# Altium schematic sheet DCDC_Hall.SchDoc
size 420 x 297 mm; Address1: Address1; Address2: Address2; Address3: Address3; Address4: Address4; SheetNumber: 1; Scale: 1:1; Разраб.: Иванов; Обозначение документа: АБВГ.123456.001 Э3; Пров.: Петров; Утв.: Сидоров; Наименование организации: ОАО "Концерн "МПО-Гидроприбор"; Перв. применение: АБВГ.123456.000; Наименование изделия 1: Плата; Наименование изделия 2: Схема электрическая; Наименование изделия 3: принципиальная; Нач. отд.: Нач. отд.; Фамилия нач. отд.: Сидоров
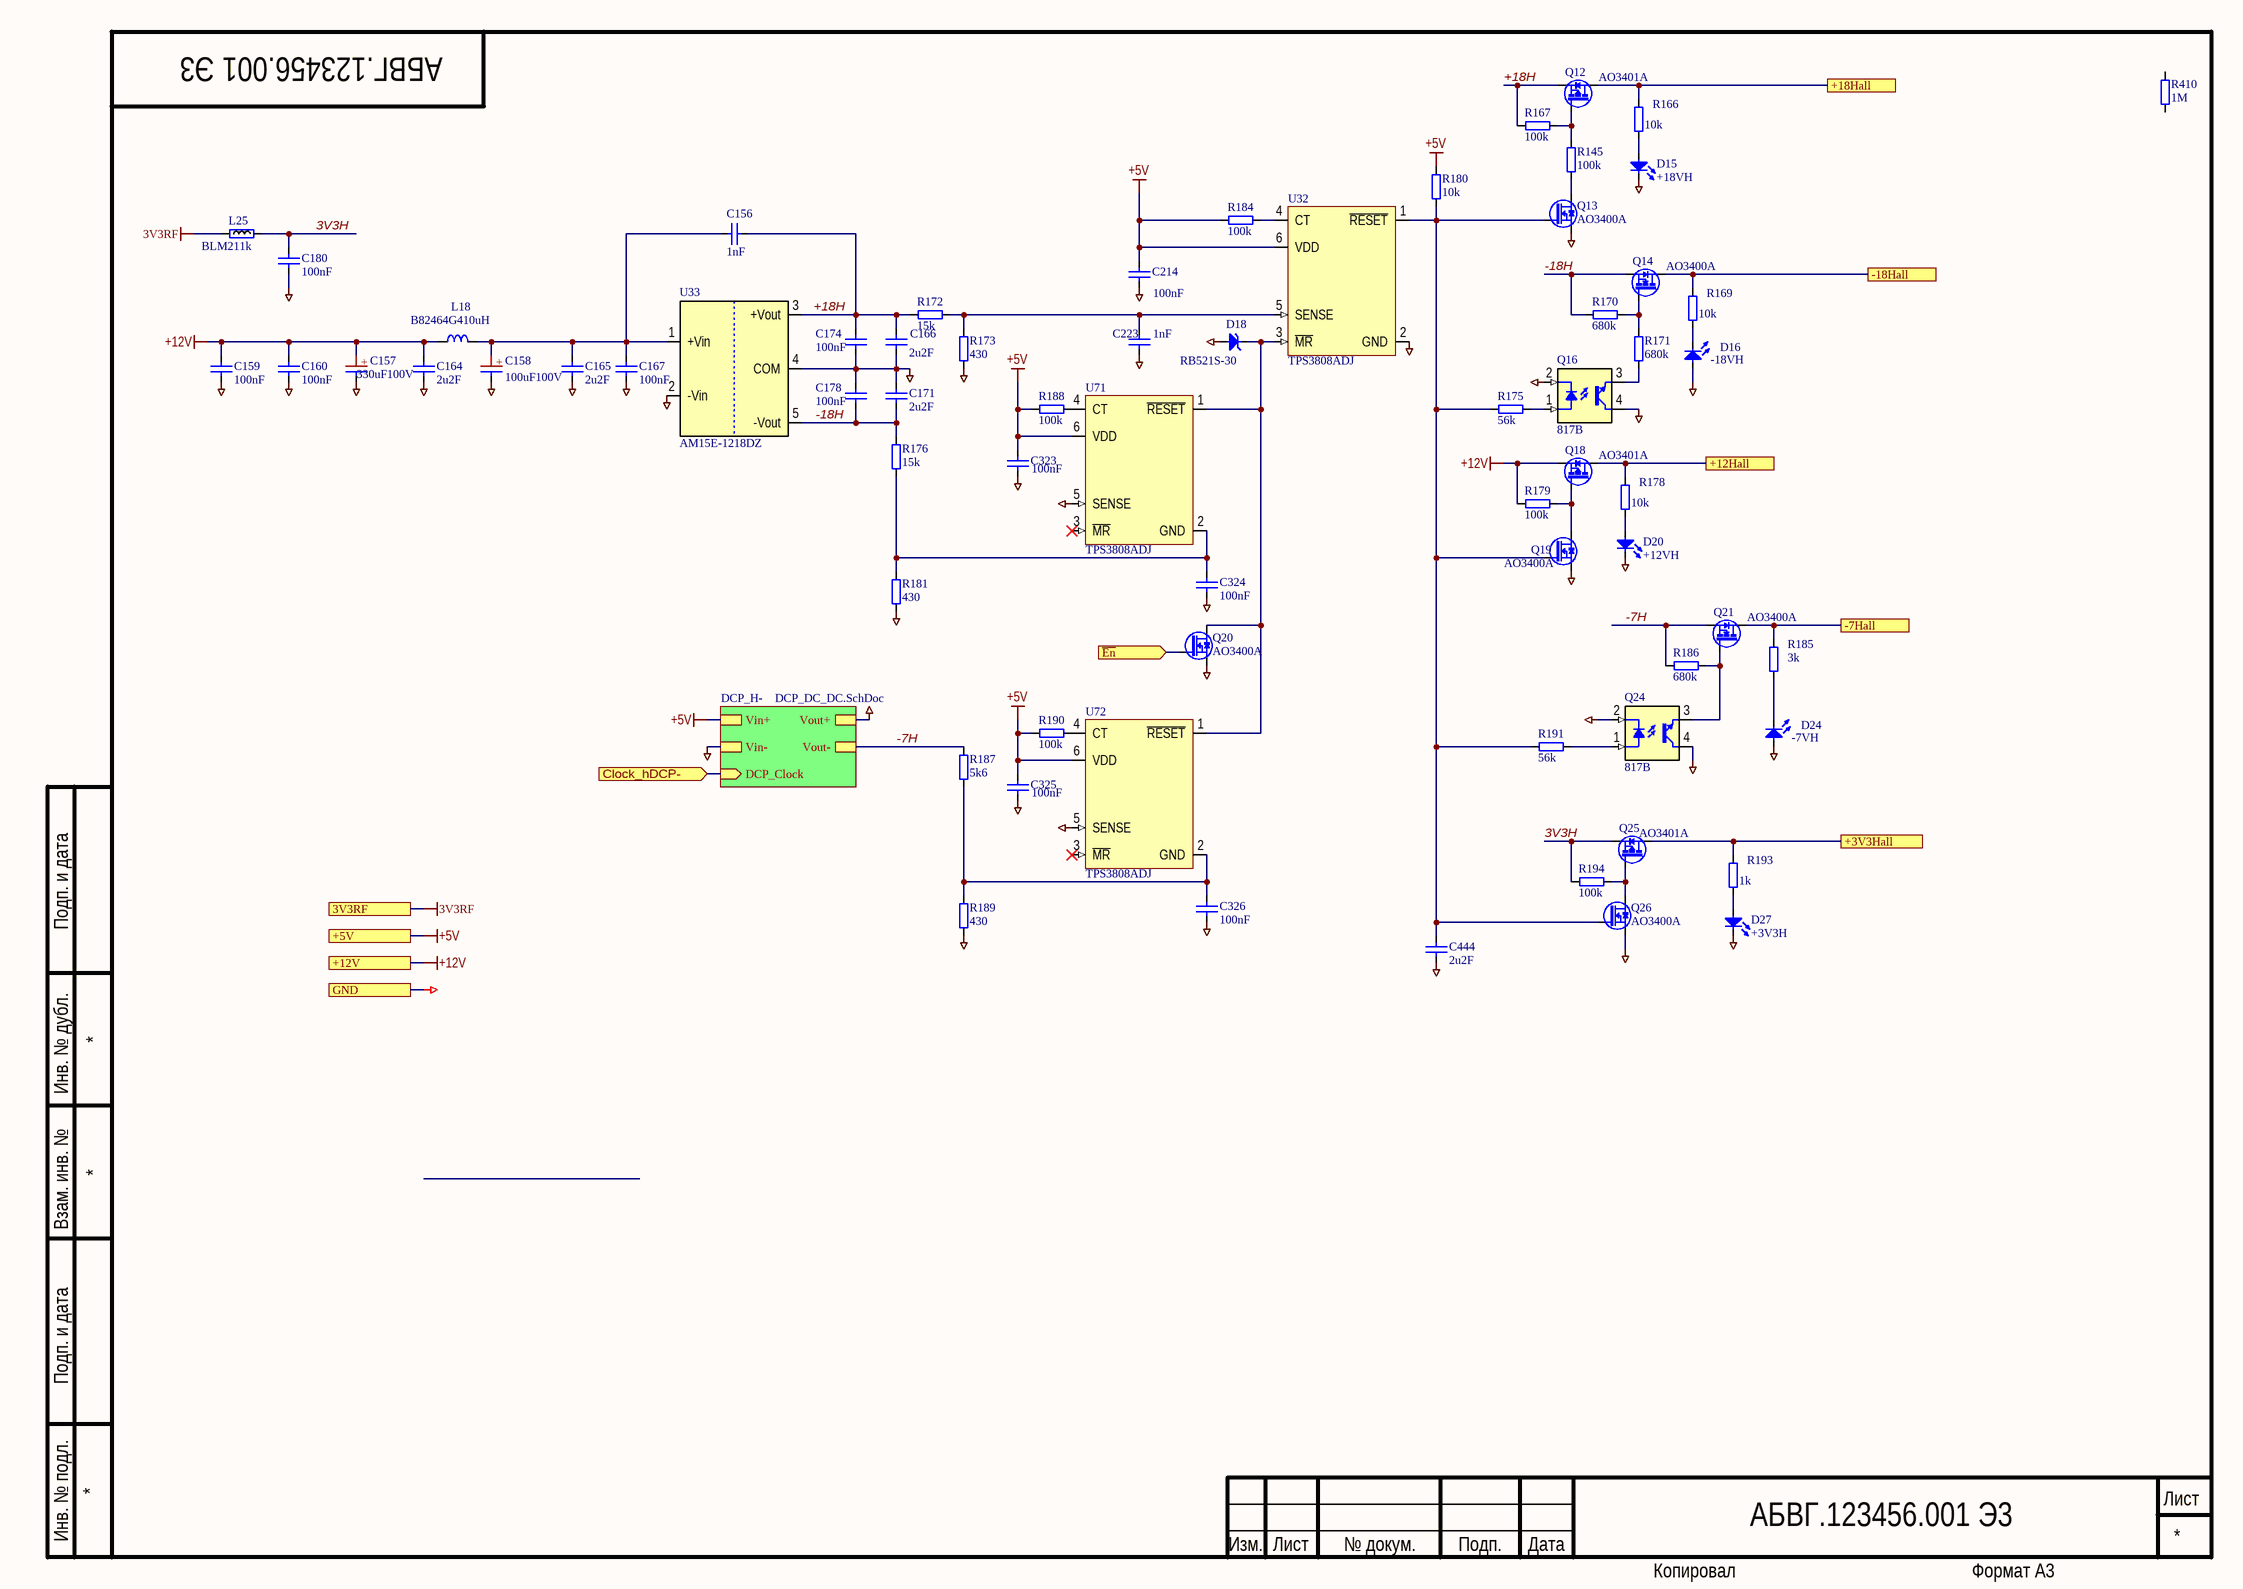
[diagram p0: DCDC_Hall.SchDoc]

## Parts
C156  1nF  [SMD0805CAP]
C157  330uF100V  [CAPPR750-1600X2000]
C158  100uF100V  [CAPPR500-1000X1250]
C159  100nF  [SMD0805CAP]
C160  100nF  [SMD0805CAP]
C164  2u2F  [SMD0805CAP]
C165  2u2F  [SMD0805CAP]
C166  2u2F  [SMD0805CAP]
C167  100nF  [SMD0805CAP]
C171  2u2F  [SMD0805CAP]
C174  100nF  [SMD0805CAP]
C178  100nF  [SMD0805CAP]
C180  100nF  [SMD0805CAP]
C214  100nF  [SMD0805CAP]
C223  1nF  [SMD0805CAP]
C323  100nF  [SMD0805CAP]
C324  100nF  [SMD0805CAP]
C325  100nF  [SMD0805CAP]
C326  100nF  [SMD0805CAP]
C444  2u2F  [SMD0805CAP]
D15  +18VH  [LED0603]
D16  -18VH  [LED0603]
D18  RB521S-30  [SODFL1608X65N]
D20  +12VH  [LED0603]
D24  -7VH  [LED0603]
D27  +3V3H  [LED0603]
L18  B82464G410uH  [IND_COILCRAFT_MSS1038]
L25  BLM211k  [RESC2012X50N]
Q12  AO3401A  [SOT95P229X119-3N]
Q13  AO3400A  [SOT95P229X119-3N]
Q14  AO3400A  [SOT95P229X119-3N]
Q16  817B  [DIP4-300]
Q18  AO3401A  [SOT95P229X119-3N]
Q19  AO3400A  [SOT95P229X119-3N]
Q20  AO3400A  [SOT95P229X119-3N]
Q21  AO3400A  [SOT95P229X119-3N]
Q24  817B  [DIP4-300]
Q25  AO3401A  [SOT95P229X119-3N]
Q26  AO3400A  [SOT95P229X119-3N]
R145  100k  [SMD0805RES]
R166  10k  [SMD0805RES]
R167  100k  [SMD0805RES]
R169  10k  [SMD0805RES]
R170  680k  [SMD0805RES]
R171  680k  [SMD0805RES]
R172  15k  [SMD0805RES]
R173  430  [SMD0805RES]
R175  56k  [SMD0805RES]
R176  15k  [SMD0805RES]
R178  10k  [SMD0805RES]
R179  100k  [SMD0805RES]
R180  10k  [SMD0805RES]
R181  430  [SMD0805RES]
R184  100k  [SMD0805RES]
R185  3k  [SMD0805RES]
R186  680k  [SMD0805RES]
R187  5k6  [SMD0805RES]
R188  100k  [SMD0805RES]
R189  430  [SMD0805RES]
R190  100k  [SMD0805RES]
R191  56k  [SMD0805RES]
R193  1k  [SMD0805RES]
R194  100k  [SMD0805RES]
R410  1M  [SMD0805RES]
U32  TPS3808ADJ  [SOT95P270X145-6N]
U33  AM15E-1218DZ  [AM15E]
U71  TPS3808ADJ  [SOT95P270X145-6N]
U72  TPS3808ADJ  [SOT95P270X145-6N]

## Sub-sheets
DCP_H- = DCP_DC_DC.SchDoc: DCP_Clock (in), Vout+, Vout-, Vin-, Vin+

## Ports
3V3RF, +3V3Hall, +5V, +12Hall, +12V, +18Hall, -7Hall, -18Hall, Clock_hDCP- (in), GND, ~{En} (in)

## Nets
3V3RF: L25.2 ; port 3V3RF
+5V: C214.2 C323.2 C325.2 R180.1 R184.1 R188.1 R190.1 U32.6(VDD) U71.6(VDD) U72.6(VDD) ; port +5V, sheet DCP_H-/Vin+
+12V: C157.1(+) C159.2 C160.2 C164.2 L18.1 Q18.2(S) R179.2 ; port +12V
GND: C157.2 C158.2 C159.1 C160.1 C164.1 C165.1 C166.1 C167.2 C171.2 C174.2 C178.1 C180.1 C214.1 C223.1 C323.1 C324.2 C325.1 C326.2 C444.2 D15.1(C) D16.2(A) D18.2(A) D20.1(C) D24.2(A) D27.1(C) Q13.2(S) Q16.2(C) Q16.4(C) Q19.2(S) Q20.2(S) Q24.2(C) Q24.4(C) Q26.2(S) R173.1 R181.1 R189.1 U32.2(GND) U33.2(-Vin) U33.4(COM) U71.5(SENSE) U72.5(SENSE) ; port GND, sheet DCP_H-/Vout+, sheet DCP_H-/Vin-
3V3H: C180.2 L25.1 Q25.2(S) R194.2
+3V3Hall: Q25.3(D) R193.2 ; port +3V3Hall
+12Hall: Q18.3(D) R178.2 ; port +12Hall
+18H: C156.2 C166.2 C174.1 Q12.2(S) R167.2 R172.2 U33.3(+Vout)
+18Hall: Q12.3(D) R166.2 ; port +18Hall
-7H: Q21.2(S) R186.2 R187.1 ; sheet DCP_H-/Vout-
-7Hall: Q21.3(D) R185.2 ; port -7Hall
-18H: C171.1 C178.2 Q14.2(S) R170.2 R176.1 U33.5(-Vout)
-18Hall: Q14.3(D) R169.2 ; port -18Hall
~{En}: Q20.1(G) ; port ~{En}
Clock_hDCP-: port Clock_hDCP-, sheet DCP_H-/DCP_Clock
NetC156_1: C156.1 C158.1(+) C165.2 C167.1 L18.2 U33.1(+Vin)
NetC223_2: C223.2 R172.1 R173.2 U32.5(SENSE)
NetC324_1: C324.1 R176.2 R181.2 U71.2(GND)
NetC326_1: C326.1 R187.2 R189.2 U72.2(GND)
NetC444_1: C444.1 Q13.1(G) Q19.1(G) Q26.1(G) R175.1 R180.2 R191.1 U32.1(~{RESET})
NetD15_2: D15.2(A) R166.1
NetD16_1: D16.1(C) R169.1
NetD18_1: D18.1(C) Q20.3(D) U32.3(~{MR}) U71.1(~{RESET}) U72.1(~{RESET})
NetD20_2: D20.2(A) R178.1
NetD24_1: D24.1(C) R185.1
NetD27_2: D27.2(A) R193.1
NetQ12_1: Q12.1(G) R145.2 R167.1
NetQ13_3: Q13.3(D) R145.1
NetQ14_1: Q14.1(G) R170.1 R171.2
NetQ16_1: Q16.1(A) R175.2
NetQ16_3: Q16.3(E) R171.1
NetQ18_1: Q18.1(G) Q19.3(D) R179.1
NetQ21_1: Q21.1(G) Q24.3(E) R186.1
NetQ24_1: Q24.1(A) R191.2
NetQ25_1: Q25.1(G) Q26.3(D) R194.1
NetR184_2: R184.2 U32.4(CT)
NetR188_2: R188.2 U71.4(CT)
NetR190_2: R190.2 U72.4(CT)

Not connected (* = marked no-connect by the designer): R410 1 2; U71 3(~{MR})*; U72 3(~{MR})*

## Notes on the sheet
- Подп. и дата
- Инв. № дубл.
- Взам. инв. №
- Инв. № подл.
- Изм.
- Лист
- № докум.
- Подп.
- Дата
- Копировал
- Формат А3

## Library data of the parts
C156 C159 C160 C164-C167 C171 C174 C178 C180 C214 C223 C323-C326 C444 = C0805: Чип конденсатор 0805; Voltage: 25V; Vendor: Vishay; DielectricType: X5R; SMD Solders: 2; Solder Option: RM; Tolerance: 20%; Pkg: SMD0805; Device: Cap0805; Price: 2
  C156 C223: Value: 1nF
  C159 C160 C167 C174 C178 C180 C214 C323-C326: Value: 100nF
  C164-C166 C171 C444: Value: 2u2F
C157 = CAP_POL_7_5x16: Конденсатор полярный d16 p7.5мм; Voltage: 100V; Vendor: Vishay; Value: 330uF; SMD Solders: 0; Solder Option: RM; Tolerance: 20%; Pkg: 7.5x16mm; Device: Cap+; THD Solders: 2; Price: 30
C158 = CAP_POL_5x10: Конденсатор полярный d10 p5мм; Voltage: 100V; Vendor: Vishay; Value: 100uF; SMD Solders: 0; Solder Option: RM; Tolerance: 20%; Pkg: 5x10mm; Device: Cap+; THD Solders: 2; Price: 20
D15 D16 D20 D24 D27 = LED0603: Чип светодиод 0603; Vendor: KB; SMD Solders: 2; Solder Option: RM; Pkg: SMD0603; Price: 10; Device: LED0603
  D15: Value: +18VH
  D16: Value: -18VH
  D20: Value: +12VH
  D24: Value: -7VH
  D27: Value: +3V3H
D18 = RB521S-30: Чип Шоттки диод; Vendor: CTK; Voltage: 30V; SMD Solders: 2; Solder Option: RM; Pkg: SOD523; Price: 5; Device: RB521S-30; Name to order: RB521S-30
L18 = B82464G4: SMD Дроссель; Vendor: Epcos; Value: 10uH; Voltage: 2; Solder Option: RM; Tolerance: 20%; Pkg: SMD10.4x10.4mm; THD Solders: 0; Name to order: B82464G4103M; Current: 3A5; Price: 400; SMD Solders: 2; Device: B82464G4
L25 = BLM21: SMD Ferrite bead 0805; Vendor: Vishay; Value: 1k; Pkg: SMD0805; SMD Solders: 2; Solder Option: RM; Price: 10; Device: BLM21
Q12 Q18 Q25 = AO3401A: PMOS; Vendor: UMW; Pkg: SOT23; SMD Solders: 3; Solder Option: RM; THD Solders: 0; Voltage: -30V; Price: 10; Device: AO3401A; Name to order: AO3401A
Q13 Q14 Q19-Q21 Q26 = AO3400A: NMOS; Vendor: UMW; Pkg: SOT23; SMD Solders: 3; Solder Option: RM; Voltage: 30V; Price: 10; Device: AO3400A; Name to order: AO3400A
Q16 Q24 = 817B: Optotransistor; Pkg: DIP4; SMD Solders: 0; Solder Option: RM; THD Solders: 4; Vendor: UMW; Voltage: 35V; Device: 817B; Price: 10; Name to order: 817B; Current: 0
R145 R166 R167 R169-R173 R175 R176 R178-R181 R184-R191 R193 R194 R410 = R0805: Чип резистор 0805; Vendor: Vishay; SMD Solders: 2; Solder Option: RM; TC: 100ppm/C; Tolerance: 1%; Pkg: SMD0805; Pwr: 125mW; Device: Res0805; Price: 2
  R145 R167 R179 R184 R188 R190 R194: Value: 100k
  R166 R169 R178 R180: Value: 10k
  R170 R171 R186: Value: 680k
  R172 R176: Value: 15k
  R173 R181 R189: Value: 430
  R175 R191: Value: 56k
  R185: Value: 3k
  R187: Value: 5k6
  R193: Value: 1k
  R410: Value: 1M
U32 U71 U72 = TPS3808: Supervisory Circuit. Low-Quiescent-Current, Programmable-Delay; Vendor: Texas Instruments; Value: ADJ; Pkg: SOT23-6; SMD Solders: 6; Solder Option: RM; THD Solders: 0; Name to order: TPS3808G01DBV; Current: 6uA; thVoltage: 400mV; Price: 200; Device: TPS3808
U33 = AM15E-: Negative LDO Linear stabilizer; Vendor: Aimtec; Value: 1218DZ; Pkg: DCDC_5; SMD Solders: 0; Solder Option: RM; THD Solders: 5; Name to order: AM15-1218DZ; Price: 2000; Device: AM15E-